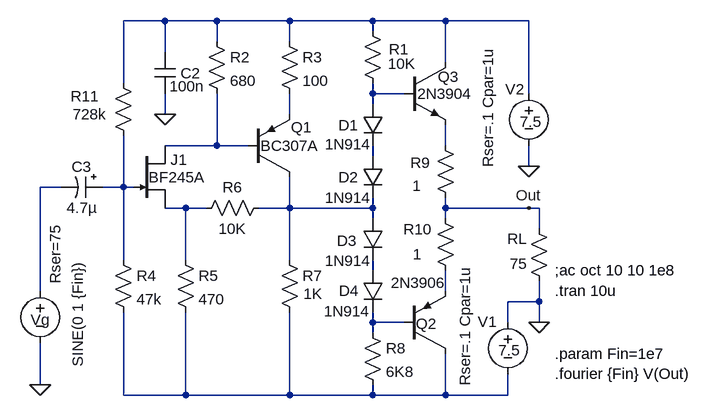
[diagram p0: schematic PwrVidAmpPart.asc]
PwrVidAmpPart.asc, the LTspice schematic file:
Version 4
SHEET 1 880 680
WIRE -272 448 -272 288
WIRE -272 592 -272 528
WIRE -240 288 -272 288
WIRE -144 128 -144 32
WIRE -144 288 -176 288
WIRE -144 288 -144 208
WIRE -144 400 -144 288
WIRE -144 608 -144 480
WIRE -128 288 -144 288
WIRE -80 32 -144 32
WIRE -80 80 -80 32
WIRE -80 176 -80 144
WIRE -48 320 -80 320
WIRE -48 400 -48 320
WIRE -48 608 -144 608
WIRE -48 608 -48 480
WIRE -16 320 -48 320
WIRE 0 32 -80 32
WIRE 0 64 0 32
WIRE 0 224 -80 224
WIRE 0 224 0 144
WIRE 48 224 0 224
WIRE 112 32 0 32
WIRE 112 64 112 32
WIRE 112 176 112 144
WIRE 112 320 64 320
WIRE 112 320 112 272
WIRE 112 400 112 320
WIRE 112 608 -48 608
WIRE 112 608 112 480
WIRE 240 32 112 32
WIRE 240 48 240 32
WIRE 240 144 240 128
WIRE 240 160 240 144
WIRE 240 240 240 224
WIRE 240 320 112 320
WIRE 240 320 240 304
WIRE 240 336 240 320
WIRE 240 416 240 400
WIRE 240 496 240 480
WIRE 240 512 240 496
WIRE 240 608 112 608
WIRE 240 608 240 592
WIRE 288 144 240 144
WIRE 288 496 240 496
WIRE 352 32 240 32
WIRE 352 96 352 32
WIRE 352 224 352 192
WIRE 352 320 352 304
WIRE 352 336 352 320
WIRE 352 448 352 416
WIRE 352 608 240 608
WIRE 352 608 352 544
WIRE 448 496 448 464
WIRE 448 608 352 608
WIRE 448 608 448 576
WIRE 480 32 352 32
WIRE 480 144 480 32
WIRE 480 256 480 224
WIRE 480 320 352 320
WIRE 496 320 480 320
WIRE 496 352 496 320
WIRE 496 464 448 464
WIRE 496 464 496 432
WIRE 496 496 496 464
FLAG 496 496 0
FLAG -80 176 0
FLAG 480 320 Out
FLAG 480 256 0
FLAG -272 592 0
SYMBOL njf -128 224 R0
WINDOW 0 57 22 Left 0
WINDOW 3 23 49 Left 0
SYMATTR InstName J1
SYMATTR Value BF245A
SYMBOL pnp2 48 272 M180
WINDOW 0 66 76 Left 0
WINDOW 3 19 48 Left 0
SYMATTR InstName Q1
SYMATTR Value BC307A
SYMBOL pnp2 288 544 M180
WINDOW 0 18 46 Left 0
WINDOW 3 -20 109 Left 0
SYMATTR InstName Q2
SYMATTR Value 2N3906
SYMBOL npn2 288 96 R0
WINDOW 0 52 22 Left 0
WINDOW 3 21 48 Left 0
SYMATTR InstName Q3
SYMATTR Value 2N3904
SYMBOL diode 224 160 R0
WINDOW 0 -37 33 Left 0
WINDOW 3 -58 62 Left 0
SYMATTR InstName D1
SYMATTR Value 1N914
SYMBOL res 224 32 R0
WINDOW 0 41 44 Left 0
WINDOW 3 39 66 Left 0
SYMATTR InstName R1
SYMATTR Value 10K
SYMATTR SpiceLine tol=1 pwr=0.1
SYMBOL res -16 48 R0
SYMATTR InstName R2
SYMATTR Value 680
SYMATTR SpiceLine tol=1 pwr=0.1
SYMBOL res 96 48 R0
SYMATTR InstName R3
SYMATTR Value 100
SYMATTR SpiceLine tol=1 pwr=0.1
SYMBOL res -160 384 R0
SYMATTR InstName R4
SYMATTR Value 47k
SYMATTR SpiceLine tol=1 pwr=0.1
SYMBOL res -64 384 R0
SYMATTR InstName R5
SYMATTR Value 470
SYMATTR SpiceLine tol=1 pwr=0.1
SYMBOL res 80 304 R90
WINDOW 0 0 56 VBottom 0
WINDOW 3 32 56 VTop 0
SYMATTR InstName R6
SYMATTR Value 10K
SYMATTR SpiceLine tol=1 pwr=0.1
SYMBOL res 96 384 R0
WINDOW 3 37 68 Left 0
SYMATTR Value 1K
SYMATTR InstName R7
SYMATTR SpiceLine tol=1 pwr=0.1
SYMBOL res 224 496 R0
SYMATTR InstName R8
SYMATTR Value 6K8
SYMATTR SpiceLine tol=1 pwr=0.1
SYMBOL res 336 208 R0
WINDOW 0 -38 42 Left 0
WINDOW 3 -35 78 Left 0
SYMATTR InstName R9
SYMATTR Value 1
SYMATTR SpiceLine tol=1 pwr=0.1
SYMBOL res 336 320 R0
WINDOW 0 -49 33 Left 0
WINDOW 3 -34 71 Left 0
SYMATTR InstName R10
SYMATTR Value 1
SYMATTR SpiceLine tol=1 pwr=0.1
SYMBOL res 480 336 R0
WINDOW 0 -33 31 Left 0
WINDOW 3 -29 70 Left 0
SYMATTR InstName RL
SYMATTR Value 75
SYMATTR SpiceLine tol=1 pwr=0.1
SYMBOL cap -96 80 R0
WINDOW 0 40 33 Left 0
WINDOW 3 23 53 Left 0
SYMATTR InstName C2
SYMATTR Value 100n
SYMBOL polcap -176 272 R90
WINDOW 0 0 32 VBottom 0
WINDOW 3 32 32 VTop 0
SYMATTR InstName C3
SYMATTR Value 4.7µ
SYMATTR Description Capacitor
SYMATTR Type cap
SYMATTR SpiceLine V=50 Irms=170m Rser=1 MTBF=5000 Lser=0 Rpar=1e8 mfg="Nichicon" pn="UPG1H4R7MPH" type="Al electrolytic" ppPkg=1
SYMBOL diode 224 240 R0
WINDOW 0 -37 33 Left 0
WINDOW 3 -58 64 Left 0
SYMATTR InstName D2
SYMATTR Value 1N914
SYMBOL diode 224 336 R0
WINDOW 0 -39 34 Left 0
WINDOW 3 -58 65 Left 0
SYMATTR InstName D3
SYMATTR Value 1N914
SYMBOL diode 224 416 R0
WINDOW 0 -36 31 Left 0
WINDOW 3 -59 63 Left 0
SYMATTR InstName D4
SYMATTR Value 1N914
SYMBOL voltage -272 432 R0
WINDOW 0 -15 60 Left 0
WINDOW 3 58 -30 VRight 0
WINDOW 39 23 -87 VRight 0
SYMATTR InstName Vg
SYMATTR Value SINE(0 1 {Fin})
SYMATTR SpiceLine Rser=75
SYMATTR Value2 AC 1
SYMBOL voltage 480 128 R0
WINDOW 0 -36 9 Left 0
WINDOW 3 -14 59 Left 0
WINDOW 123 0 0 Left 0
WINDOW 39 -63 -56 VRight 0
SYMATTR InstName V2
SYMATTR Value 7.5
SYMATTR SpiceLine Rser=.1 Cpar=1u
SYMBOL voltage 448 480 R0
WINDOW 0 -46 15 Left 0
WINDOW 3 -15 59 Left 0
WINDOW 123 0 0 Left 0
WINDOW 39 -66 -72 VRight 0
SYMATTR InstName V1
SYMATTR Value 7.5
SYMATTR SpiceLine Rser=.1 Cpar=1u
SYMBOL res -160 112 R0
WINDOW 0 -65 36 Left 0
WINDOW 3 -62 64 Left 0
SYMATTR InstName R11
SYMATTR Value 728k
SYMATTR SpiceLine tol=1 pwr=0.1
TEXT 520 544 Left 0 !.param Fin=1e7\n.fourier {Fin} V(Out)
TEXT 520 416 Left 0 !;ac oct 10 10 1e8\n.tran 10u

The netlist it stands for:
* PwrVidAmpPart.asc
J1 N006 N003 N005 BF245A
Q1 N008 N006 N007 0 BC307A
Q2 N004 N012 N014 0 2N3906
Q3 N002 N009 N013 0 2N3904
D1 N009 N010 1N914
R1 N002 N009 10K tol=1 pwr=0.1
R2 N002 N006 680 tol=1 pwr=0.1
R3 N002 N007 100 tol=1 pwr=0.1
R4 N003 N004 47k tol=1 pwr=0.1
R5 N005 N004 470 tol=1 pwr=0.1
R6 N008 N005 10K tol=1 pwr=0.1
R7 N008 N004 1K tol=1 pwr=0.1
R8 N012 N004 6K8 tol=1 pwr=0.1
R9 N013 Out 1 tol=1 pwr=0.1
R10 Out N014 1 tol=1 pwr=0.1
RL Out 0 75 tol=1 pwr=0.1
C2 N002 0 100n
C3 N003 N001 4.7µ V=50 Irms=170m Rser=1 MTBF=5000 Lser=0 Rpar=1e8 mfg="Nichicon" pn="UPG1H4R7MPH" type="Al electrolytic" ppPkg=1
D2 N010 N008 1N914
D3 N008 N011 1N914
D4 N011 N012 1N914
Vg N001 0 SINE(0 1 {Fin}) AC 1 Rser=75
V2 N002 0 7.5 Rser=.1 Cpar=1u
V1 0 N004 7.5 Rser=.1 Cpar=1u
R11 N002 N003 728k tol=1 pwr=0.1
.model D D
.lib standard.dio
.model NPN NPN
.model PNP PNP
.lib standard.bjt
.model NJF NJF
.model PJF PJF
.lib standard.jft
.param Fin=1e7
.fourier {Fin} V(Out)
;ac oct 10 10 1e8
.tran 10u
.backanno
.end